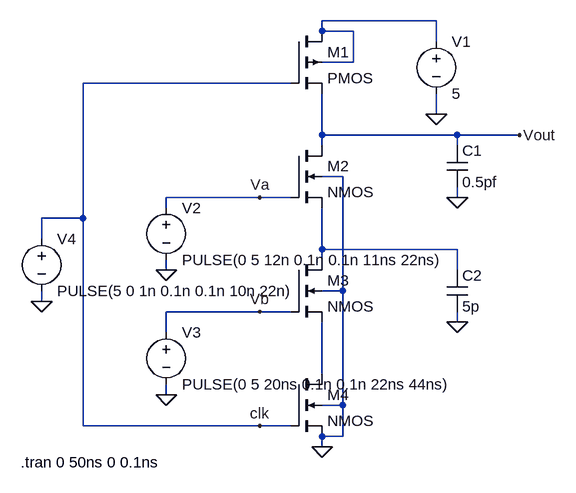
[diagram p0: schematic charge sharing.asc]
charge sharing.asc, the LTspice schematic file:
Version 4
SHEET 1 880 728
WIRE 416 32 240 32
WIRE 240 48 240 32
WIRE 288 48 240 48
WIRE 416 64 416 32
WIRE 288 96 288 48
WIRE 288 96 240 96
WIRE 192 128 -128 128
WIRE 416 176 416 144
WIRE 240 208 240 144
WIRE 448 208 240 208
WIRE 544 208 448 208
WIRE 240 224 240 208
WIRE 448 224 448 208
WIRE 272 272 240 272
WIRE 144 304 0 304
WIRE 192 304 144 304
WIRE 448 304 448 288
WIRE 0 320 0 304
WIRE -128 336 -128 128
WIRE -128 336 -192 336
WIRE -192 368 -192 336
WIRE 240 384 240 320
WIRE 448 384 240 384
WIRE 240 400 240 384
WIRE 0 416 0 400
WIRE 448 416 448 384
WIRE 272 448 272 272
WIRE 272 448 240 448
WIRE -192 464 -192 448
WIRE 144 480 0 480
WIRE 192 480 144 480
WIRE 448 496 448 480
WIRE 0 512 0 480
WIRE 240 576 240 496
WIRE 0 608 0 592
WIRE 272 624 272 448
WIRE 272 624 240 624
WIRE -128 656 -128 336
WIRE 144 656 -128 656
WIRE 192 656 144 656
WIRE 272 672 272 624
WIRE 272 672 240 672
WIRE 240 688 240 672
FLAG 240 688 0
FLAG 416 176 0
FLAG 0 416 0
FLAG 0 608 0
FLAG 448 304 0
FLAG 448 496 0
FLAG -192 464 0
FLAG 144 304 Va
FLAG 144 480 Vb
FLAG 144 656 clk
FLAG 544 208 Vout
SYMBOL pmos4 192 48 R0
SYMATTR InstName M1
SYMATTR Value2 l=120n w=360n
SYMBOL nmos4 192 224 R0
SYMATTR InstName M2
SYMATTR Value2 l=120n w=360n
SYMBOL nmos4 192 400 R0
SYMATTR InstName M3
SYMATTR Value2 l=120n w=360n
SYMBOL nmos4 192 576 R0
SYMATTR InstName M4
SYMATTR Value2 l=120n w=360n
SYMBOL voltage 416 48 R0
WINDOW 123 0 0 Left 0
WINDOW 39 0 0 Left 0
SYMATTR InstName V1
SYMATTR Value 5
SYMBOL voltage 0 304 R0
WINDOW 123 0 0 Left 0
WINDOW 39 0 0 Left 0
SYMATTR InstName V2
SYMATTR Value PULSE(0 5 12n 0.1n 0.1n 11ns 22ns)
SYMBOL voltage 0 496 R0
WINDOW 123 0 0 Left 0
WINDOW 39 0 0 Left 0
SYMATTR InstName V3
SYMATTR Value PULSE(0 5 20ns 0.1n 0.1n 22ns 44ns)
SYMBOL voltage -192 352 R0
WINDOW 123 0 0 Left 0
WINDOW 39 0 0 Left 0
SYMATTR InstName V4
SYMATTR Value PULSE(5 0 1n 0.1n 0.1n 10n 22n)
SYMBOL cap 432 224 R0
SYMATTR InstName C1
SYMATTR Value 0.5pf
SYMBOL cap 432 416 R0
SYMATTR InstName C2
SYMATTR Value 5p
TEXT -224 712 Left 2 !.tran 0 50ns 0 0.1ns

The netlist it stands for:
* charge sharing.asc
M1 N001 clk Vout N001 PMOS l=120n w=360n
M2 Vout Va N002 0 NMOS l=120n w=360n
M3 N002 Vb N003 0 NMOS l=120n w=360n
M4 N003 clk 0 0 NMOS l=120n w=360n
V1 N001 0 5
V2 Va 0 PULSE(0 5 12n 0.1n 0.1n 11ns 22ns)
V3 Vb 0 PULSE(0 5 20ns 0.1n 0.1n 22ns 44ns)
V4 clk 0 PULSE(5 0 1n 0.1n 0.1n 10n 22n)
C1 Vout 0 0.5pf
C2 N002 0 5p
.model NMOS NMOS
.model PMOS PMOS
.lib standard.mos
.tran 0 50ns 0 0.1ns
.backanno
.end